# EAGLE design wristband-pcb (EAGLE 9.6.2)
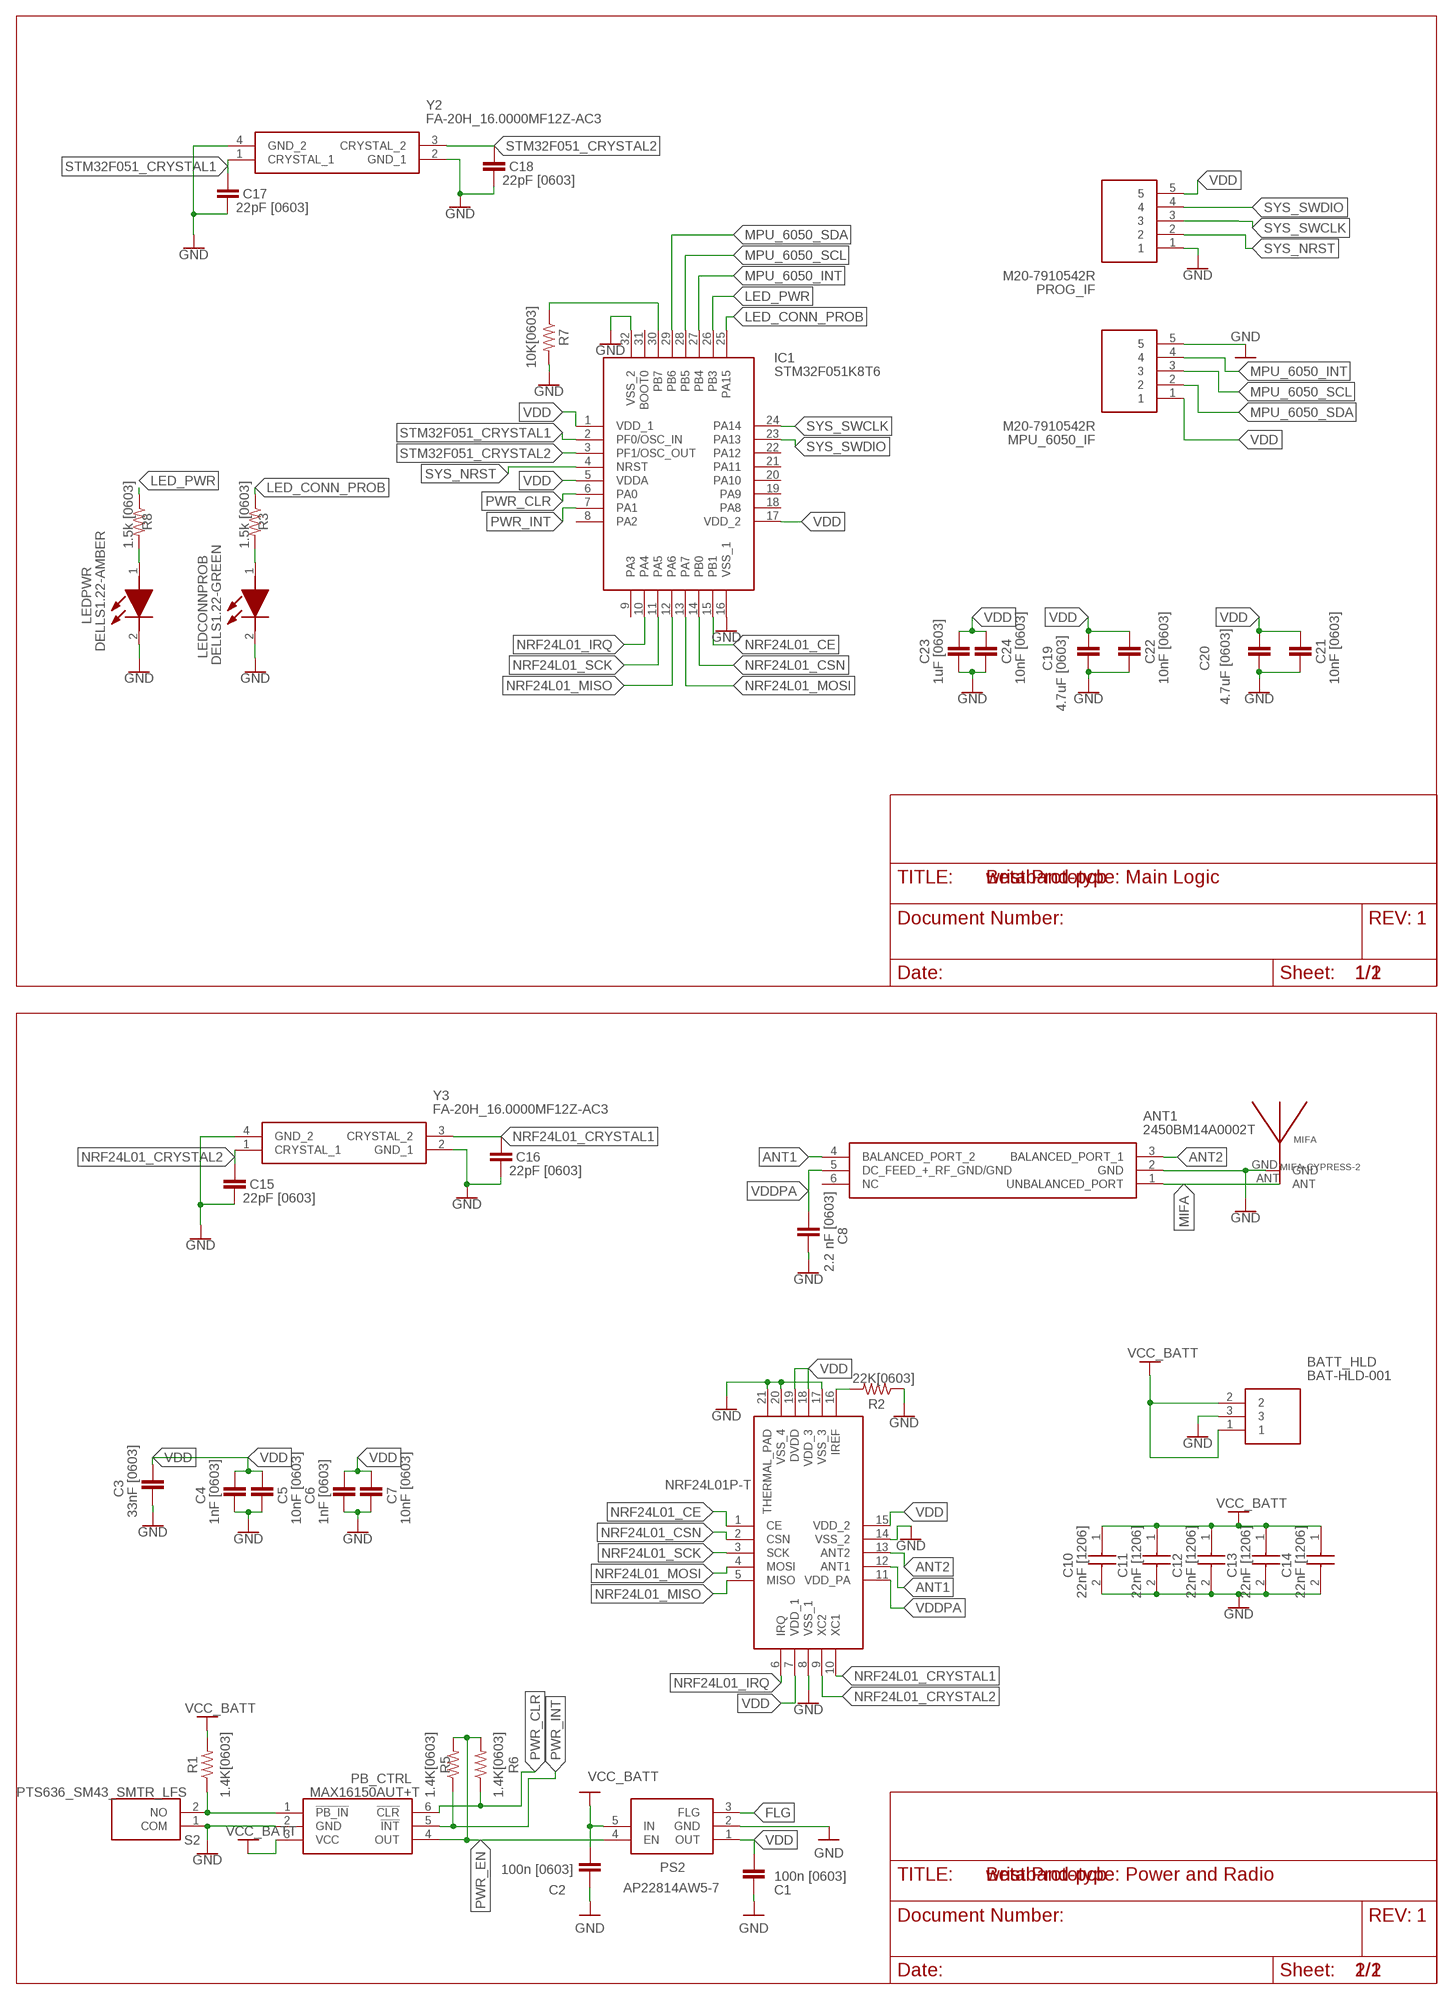
[diagram p0: schematic, sheet 1]

## Parts
ANT1  2450BM14A0002T  [2450BM14A0002T]
BATT_HLD  BAT-HLD-001  [BATHLD001]
C1  100n [0603]  C_CHIP-0603(1608-METRIC)  [CAPC1608X85]
C2  100n [0603]  C_CHIP-0603(1608-METRIC)  [CAPC1608X85]
C3  33nF [0603]  CAPACITOR_0603_L  [RESC0603_L]
C4  1nF [0603]  CAPACITOR_0603_L  [RESC0603_L]
C5  10nF [0603]  CAPACITOR_0603_L  [RESC0603_L]
C6  1nF [0603]  CAPACITOR_0603_L  [RESC0603_L]
C7  10nF [0603]  CAPACITOR_0603_L  [RESC0603_L]
C8  2.2 nF [0603]  CAPACITOR_0603_L  [RESC0603_L]
C10  22nF [1206]  CL31B226KPHNNNE  [CAPC3216X180N]
C11  22nF [1206]  CL31B226KPHNNNE  [CAPC3216X180N]
C12  22nF [1206]  CL31B226KPHNNNE  [CAPC3216X180N]
C13  22nF [1206]  CL31B226KPHNNNE  [CAPC3216X180N]
C14  22nF [1206]  CL31B226KPHNNNE  [CAPC3216X180N]
C15  22pF [0603]  CAPACITOR_0603_L  [RESC0603_L]
C16  22pF [0603]  CAPACITOR_0603_L  [RESC0603_L]
C17  22pF [0603]  CAPACITOR_0603_L  [RESC0603_L]
C18  22pF [0603]  CAPACITOR_0603_L  [RESC0603_L]
C19  4.7uF [0603]  CAPACITOR_0603_L  [RESC0603_L]
C20  4.7uF [0603]  CAPACITOR_0603_L  [RESC0603_L]
C21  10nF [0603]  CAPACITOR_0603_L  [RESC0603_L]
C22  10nF [0603]  CAPACITOR_0603_L  [RESC0603_L]
C23  1uF [0603]  CAPACITOR_0603_L  [RESC0603_L]
C24  10nF [0603]  CAPACITOR_0603_L  [RESC0603_L]
IC1  STM32F051K8T6  [QFP80P900X900X160-32N]
LEDCONNPROB  DELLS1.22-GREEN  KS_DELLS1.22-JHKI-1  [KSDELLS122JHKI1]
LEDPWR  DELLS1.22-AMBER  KS_DELLS1.22-JHKI-1  [KSDELLS122JHKI1]
MIFA  MIFA-CYPRESS-2  [MIFA-CYPRESS-2]
MPU_6050_IF  M20-7910542R  [M207910542R]
NRF24L01+  NRF24L01P-T  [QFN50P400X400X95-21N]
PB_CTRL  MAX16150AUT+T  [SOT95P280X145-6N]
PROG_IF  M20-7910542R  [M207910542R]
PS2  AP22814AW5-7  [SOT95P285X130-5N]
R1  1.4K[0603]  R-US_CHIP-0603(1608-METRIC)  [RESC1608X60]
R2  22K[0603]  R-US_CHIP-0603(1608-METRIC)  [RESC1608X60]
R3  1.5k [0603]  R-US_CHIP-0603(1608-METRIC)  [RESC1608X60]
R5  1.4K[0603]  R-US_CHIP-0603(1608-METRIC)  [RESC1608X60]
R6  1.4K[0603]  R-US_CHIP-0603(1608-METRIC)  [RESC1608X60]
R7  10K[0603]  R-US_CHIP-0603(1608-METRIC)  [RESC1608X60]
R8  1.5k [0603]  R-US_CHIP-0603(1608-METRIC)  [RESC1608X60]
S2  PTS636_SM43_SMTR_LFS  [PTS636SM43SMTRLFS]
Y2  FA-20H_16.0000MF12Z-AC3  [FA20H160000MF12ZAC3]
Y3  FA-20H_16.0000MF12Z-AC3  [FA20H160000MF12ZAC3]

## Nets
ANT1: ANT1.4(BALANCED_PORT_2) NRF24L01+.12(ANT1)
ANT2: ANT1.3(BALANCED_PORT_1) NRF24L01+.13(ANT2)
FLG: PS2.3(FLG)
GND: ANT1.2(GND) BATT_HLD.3 C1.2 C2.2 C3.2 C4.2 C5.2 C6.2 C7.2 C8.2 C10.2 C11.2 C12.2 C13.2 C14.2 C15.2 C16.2 C17.2 C18.2 C19.2 C20.2 C21.2 C22.2 C23.2 C24.2 IC1.16(VSS_1) IC1.32(VSS_2) LEDCONNPROB.2(K) LEDPWR.2(K) MIFA.GND MPU_6050_IF.5 NRF24L01+.8(VSS_1) NRF24L01+.14(VSS_2) NRF24L01+.17(VSS_3) NRF24L01+.20(VSS_4) NRF24L01+.21(THERMAL_PAD) PB_CTRL.2(GND) PROG_IF.1 PS2.2(GND) R2.1 R7.2 S2.1(COM) Y2.2(GND_1) Y2.4(GND_2) Y3.2(GND_1) Y3.4(GND_2)
LED_CONN_PROB: IC1.25(PA15) R3.1
LED_PWR: IC1.26(PB3) R8.1
MIFA: ANT1.1(UNBALANCED_PORT) MIFA.ANT
MPU_6050_INT: IC1.27(PB4) MPU_6050_IF.4
MPU_6050_SCL: IC1.28(PB5) MPU_6050_IF.3
MPU_6050_SDA: IC1.29(PB6) MPU_6050_IF.2
N$2: PB_CTRL.1(!PB_IN) R1.1 S2.2(NO)
N$3: NRF24L01+.16(IREF) R2.2
N$4: IC1.30(PB7) R7.1
N$6: LEDPWR.1(A) R8.2
N$7: LEDCONNPROB.1(A) R3.2
NRF24L01_CE: IC1.15(PB1) NRF24L01+.1(CE)
NRF24L01_CRYSTAL1: C16.1 NRF24L01+.10(XC1) Y3.3(CRYSTAL_2)
NRF24L01_CRYSTAL2: C15.1 NRF24L01+.9(XC2) Y3.1(CRYSTAL_1)
NRF24L01_CSN: IC1.14(PB0) NRF24L01+.2(CSN)
NRF24L01_IRQ: IC1.10(PA4) NRF24L01+.6(IRQ)
NRF24L01_MISO: IC1.12(PA6) NRF24L01+.5(MISO)
NRF24L01_MOSI: IC1.13(PA7) NRF24L01+.4(MOSI)
NRF24L01_SCK: IC1.11(PA5) NRF24L01+.3(SCK)
PWR_CLR: IC1.6(PA0) PB_CTRL.6(!CLR) R6.1
PWR_EN: PB_CTRL.4(OUT) PS2.4(EN) R5.2 R6.2
PWR_INT: IC1.7(PA1) PB_CTRL.5(!INT) R5.1
STM32F051_CRYSTAL1: C17.1 IC1.2(PF0/OSC_IN) Y2.1(CRYSTAL_1)
STM32F051_CRYSTAL2: C18.1 IC1.3(PF1/OSC_OUT) Y2.3(CRYSTAL_2)
SYS_NRST: IC1.4(NRST) PROG_IF.2
SYS_SWCLK: IC1.24(PA14) PROG_IF.3
SYS_SWDIO: IC1.23(PA13) PROG_IF.4
VCC_BATT: BATT_HLD.1 BATT_HLD.2 C2.1 C10.1 C11.1 C12.1 C13.1 C14.1 PB_CTRL.3(VCC) PS2.5(IN) R1.2
VDD: C1.1 C3.1 C4.1 C5.1 C6.1 C7.1 C19.1 C20.1 C21.1 C22.1 C23.1 C24.1 IC1.1(VDD_1) IC1.5(VDDA) IC1.17(VDD_2) MPU_6050_IF.1 NRF24L01+.7(VDD_1) NRF24L01+.15(VDD_2) NRF24L01+.18(VDD_3) NRF24L01+.19(DVDD) PROG_IF.5 PS2.1(OUT)
VDDPA: ANT1.5(DC_FEED_+_RF_GND/GND) C8.1 NRF24L01+.11(VDD_PA)
Unconnected: ANT1.6(NC) IC1.8(PA2) IC1.9(PA3) IC1.18(PA8) IC1.19(PA9) IC1.20(PA10) IC1.21(PA11) IC1.22(PA12) IC1.31(BOOT0)

## Notes on the sheet
- Beta Prototype: Main Logic
- 1
- 1/2
- Beta Prototype: Power and Radio
- 1
- 2/2

## Library data of the parts
ANT1 = 2450BM14A0002T:2450BM14A0002T: JOHANSON TECHNOLOGY - 2450BM14A0002T - BALUN, 2.45GHZ, IMPEDANCE MATCHED Source: Datasheet; DESCRIPTION: JOHANSON TECHNOLOGY - 2450BM14A0002T - BALUN, 2.45GHZ, IMPEDANCE MATCHED; HEIGHT: 0.7mm; MANUFACTURER_NAME: JOHANSON TECHNOLOGY; MANUFACTURER_PART_NUMBER: 2450BM14A0002T; MOUSER_PART_NUMBER: 609-2450BM14A0002T; MOUSER_PRICE-STOCK: https://www.mouser.co.uk/ProductDetail/Johanson-Technology/2450BM14A0002T?qs=yCnrNFeXz%252Bjc2NrpGmrycg%3D%3D
BATT_HLD = BAT-HLD-001:BAT-HLD-001: Coin Cell Battery Holders Linx CR2032 Battery Holder Source: Datasheet; DESCRIPTION: Coin Cell Battery Holders Linx CR2032 Battery Holder; HEIGHT: 4mm; MANUFACTURER_NAME: Linx Technologies; MANUFACTURER_PART_NUMBER: BAT-HLD-001; MOUSER_PART_NUMBER: 712-BAT-HLD-001; MOUSER_PRICE-STOCK: https://www.mouser.co.uk/ProductDetail/Linx-Technologies/BAT-HLD-001?qs=K5ta8V%252BWhta7hbVGfm4dqA%3D%3D
C1 C2 = Capacitor:C: Capacitor - Generic; CATEGORY: Capacitor
C3-C8 C15-C24 = Nordic_nRF:CAPACITOR: Generic chip capacitor
C10-C14 = CL31B226KPHNNNE:CL31B226KPHNNNE: 22F +/-10% 10V Ceramic Capacitor X7R 1206 (3216 Metric) Source: Datasheet <https://media.digikey.com/pdf/Data Sheets/Samsung PDFs/CL_Series_MLCC_ds.pdf>; DESCRIPTION: 22F +/-10% 10V Ceramic Capacitor X7R 1206 (3216 Metric); HEIGHT: 1.8mm; MANUFACTURER_NAME: Samsung Electro-Mechanics; MANUFACTURER_PART_NUMBER: CL31B226KPHNNNE; MOUSER_PART_NUMBER: N/A; MOUSER_PRICE-STOCK: https://www.mouser.co.uk/ProductDetail/Samsung-Electro-Mechanics/CL31B226KPHNNNE?qs=EHbfJsBkB6nWZLDFWYPW4w%3D%3D
IC1 = stm32f051k8t6:STM32F051K8T6: Source: Datasheet <http://www.st.com/web/en/resource/technical/document/datasheet/DM00039193.pdf>; HEIGHT: 1.6mm; MANUFACTURER_NAME: STMicroelectronics; MANUFACTURER_PART_NUMBER: STM32F051K8T6; MOUSER_PART_NUMBER: 511-STM32F051K8T6; MOUSER_PRICE-STOCK: https://www.mouser.co.uk/ProductDetail/STMicroelectronics/STM32F051K8T6?qs=gNDSiZmRJS8MM9puf%252Bb4Hg%3D%3D
LEDCONNPROB LEDPWR = KS_DELLS1.22-JHKI-1:KS_DELLS1.22-JHKI-1: Standard LEDs - SMD Super Red TOPLED E 1608 Source: Datasheet; DESCRIPTION: Standard LEDs - SMD Super Red TOPLED E 1608; HEIGHT: mm; MANUFACTURER_NAME: OSRAM; MANUFACTURER_PART_NUMBER: KS DELLS1.22-JHKI-1; MOUSER_PART_NUMBER: 720-KSDELLS122A4852; MOUSER_PRICE-STOCK: https://www.mouser.co.uk/ProductDetail/OSRAM-Opto-Semiconductors/KS-DELLS122-JHKI-1?qs=XeJtXLiO41SvlpLmj7zjqg%3D%3D
MIFA = MIFA:MIFA-CYPRESS
MPU_6050_IF PROG_IF = M20-7910542R:M20-7910542R: Headers & Wire Housings 5 WAY SIL HORIZ SMT SKT T&R Source: Datasheet <https://cdn.harwin.com/pdfs/M20-791R.pdf>; DESCRIPTION: Headers & Wire Housings 5 WAY SIL HORIZ SMT SKT T&R; HEIGHT: 2.65mm; MANUFACTURER_NAME: Harwin; MANUFACTURER_PART_NUMBER: M20-7910542R; MOUSER_PART_NUMBER: 855-M20-7910542R; MOUSER_PRICE-STOCK: https://www.mouser.co.uk/ProductDetail/Harwin/M20-7910542R?qs=k41KVqW3ymo1Rw%252BkrmwYbQ%3D%3D
NRF24L01+ = nRF24L01P-T:NRF24L01P-T: RF Transceiver IC 2.4GHz ISM Band QFN20 Nordic Semiconductor NRF24L01P-T, RF Transceiver 2400MHz to 2483.5MHz 1.9 3.6 V 20-Pin QFN Source: Datasheet <http://www.nordicsemi.com/eng/content/download/2726/34069/file/nRF24L01P_Product_Specification_1_0.pdf>; DESCRIPTION: RF Transceiver IC 2.4GHz ISM Band QFN20 Nordic Semiconductor NRF24L01P-T, RF Transceiver 2400MHz to 2483.5MHz 1.9 3.6 V 20-Pin QFN; HEIGHT: 0.95mm; MANUFACTURER_NAME: Nordic Semiconductor; MANUFACTURER_PART_NUMBER: nRF24L01P-T; MOUSER_PART_NUMBER: 949-NRF24L01P-T; MOUSER_PRICE-STOCK: https://www.mouser.co.uk/ProductDetail/Nordic-Semiconductor/nRF24L01P-T?qs=yd0qOhnSiDf9ybbDsku6vg%3D%3D
PB_CTRL = MAX16150AUT+T:MAX16150AUT+T: Supervisory Circuits Nano-Power Pushbutton ON/OFF Controller with 15kV ESD Protection and Programmable Timer Source: Datasheet; DESCRIPTION: Supervisory Circuits Nano-Power Pushbutton ON/OFF Controller with 15kV ESD Protection and Programmable Timer; HEIGHT: 1.45mm; MANUFACTURER_NAME: Maxim Integrated; MANUFACTURER_PART_NUMBER: MAX16150AUT+T; MOUSER_PART_NUMBER: 700-MAX16150AUT+T; MOUSER_PRICE-STOCK: https://www.mouser.co.uk/ProductDetail/Maxim-Integrated/MAX16150AUT%2bT?qs=wnTfsH77Xs5xR8unQygqcw%3D%3D
PS2 = AP22814AW5-7:AP22814AW5-7: DiodesZetex AP22814AW5-7, USB Power Switch, High Side, 65m, 1.6 V min. 5-Pin, SOT25 Source: Datasheet <https://componentsearchengine.com/Datasheets/2/AP22814AW5-7.pdf>; DESCRIPTION: DiodesZetex AP22814AW5-7, USB Power Switch, High Side, 65m, 1.6 V min. 5-Pin, SOT25; HEIGHT: 1.3mm; MANUFACTURER_NAME: Diodes Inc.; MANUFACTURER_PART_NUMBER: AP22814AW5-7; MOUSER_PART_NUMBER: 621-AP22814AW5-7; MOUSER_PRICE-STOCK: https://www.mouser.co.uk/ProductDetail/Diodes-Incorporated/AP22814AW5-7?qs=lqAf%2FiVYw9i7Wkgkb62RxQ%3D%3D
R1-R3 R5-R8 = Resistor:R-US: Resistor Fixed - ANSI; CATEGORY: Resistor; SUB-CATEGORY: Fixed
S2 = PTS636_SM43_SMTR_LFS:PTS636_SM43_SMTR_LFS: Tactile Switches Tact 50mA 12VDC, 6.0x3.5, 4.3mm H, 180gf, G leads, No ground pin, Black Actuator Source: Datasheet <https://componentsearchengine.com/Datasheets/1/PTS636 SM43 SMTR LFS.pdf>; DESCRIPTION: Tactile Switches Tact 50mA 12VDC, 6.0x3.5, 4.3mm H, 180gf, G leads, No ground pin, Black Actuator; HEIGHT: 4.5mm; MANUFACTURER_NAME: C & K COMPONENTS; MANUFACTURER_PART_NUMBER: PTS636 SM43 SMTR LFS; MOUSER_PART_NUMBER: 611-PTS636SM43SMTRLF; MOUSER_PRICE-STOCK: https://www.mouser.co.uk/ProductDetail/CK/PTS636-SM43-SMTR-LFS?qs=vLWxofP3U2xu5raMGkTmHg%3D%3D
Y2 Y3 = FA-20H_16.0000MF12Z-AC3:FA-20H_16.0000MF12Z-AC3: Crystals 16MHz 10ppm 9pF -20C +75C Source: Datasheet <https://support.epson.biz/td/api/doc_check.php?dl=brief_FA-20H&lang=en>; DESCRIPTION: Crystals 16MHz 10ppm 9pF -20C +75C; HEIGHT: 0.55mm; MANUFACTURER_NAME: Epson Timing; MANUFACTURER_PART_NUMBER: FA-20H 16.0000MF12Z-AC3; MOUSER_PART_NUMBER: 732-FA20H-16F12Z-AC3; MOUSER_PRICE-STOCK: https://www.mouser.co.uk/ProductDetail/Epson-Timing/FA-20H-160000MF12Z-AC3?qs=CANAagUtPAosthvbGV1%2FdA%3D%3D

## Board
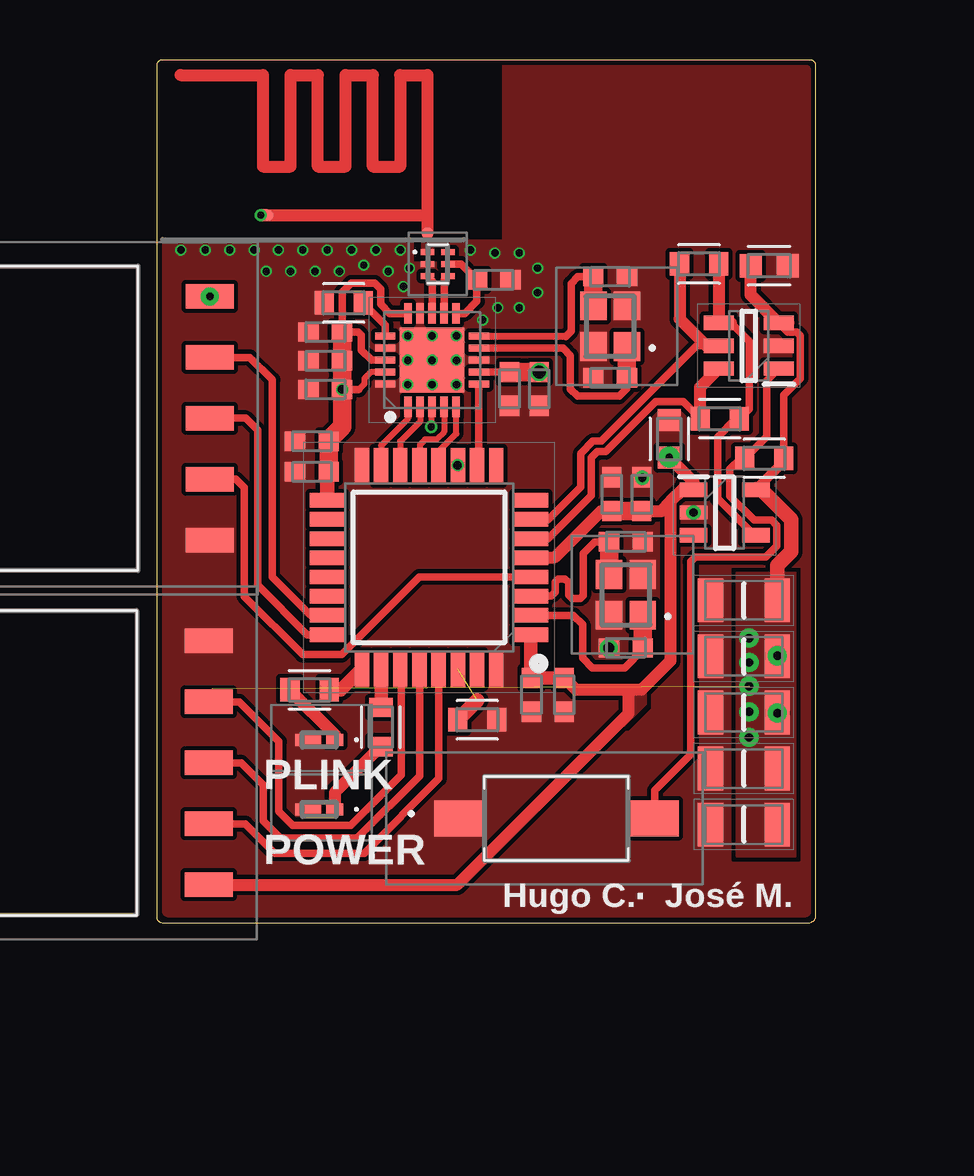
[diagram p1: board, top side]
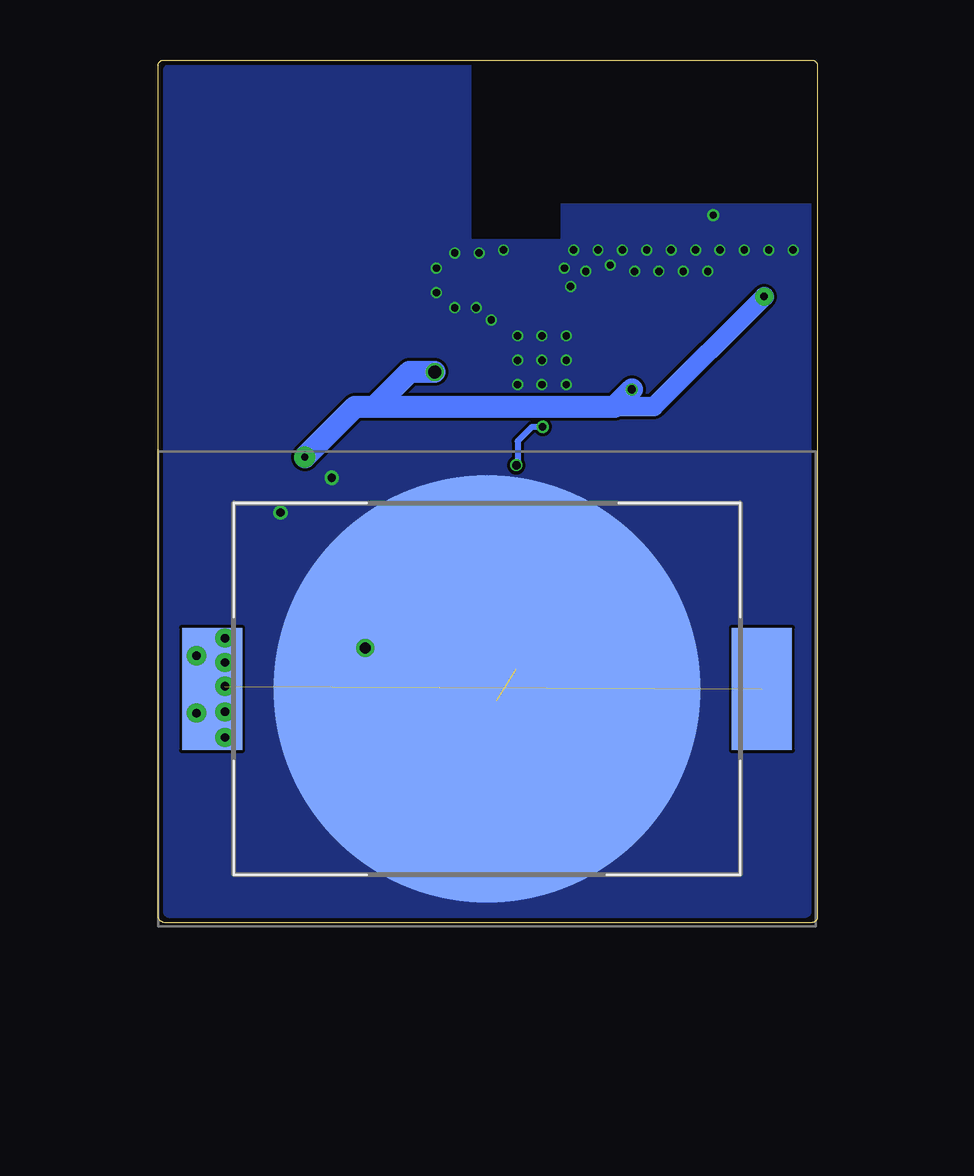
[diagram p2: board, bottom side, seen from below]

Size 27.48 x 35.96 mm. Coordinates in mm from the lower left corner, seen from the top.
Outline: 0,35.71 0,0.25 arc90 0.25,0 27.22,0 arc67 27.48,0.25 27.48,35.71 arc90 27.22,35.96 0.25,35.96 arc90 0,35.71
Copper layers (1*16): Top 0.035mm / dielectric 1.6mm / Bottom 0.035mm
Design rules "jlcpcb-2layer": minimum track width 5mil, minimum drill 0.3mm, track to track 5mil, track to pad 5mil, pad to pad 5mil, via to via 5mil, smd to smd 5mil, copper to edge 0.2mm, drill to drill 6mil, minimum pad ring 10mil, minimum via ring 3mil, stop-mask expansion 4mil, vias tented up to drill 0mil, thermal gap 10mil

### Footprints (pad centres in the part's own frame; a part is rotated, then mirrored left to right if it is on the bottom)
2450BM14A0002T = smd 0.25 x 0.55: 1 0.5,0.425; 2 0,0.425; 3 -0.5,0.425; 4 -0.5,-0.425; 5 0,-0.425; 6 0.5,-0.425
BATHLD001 = smd 2.5 x 5.1: 1 11.45,0; 2 -11.45,0 | smd 17.8 x 17.8: 3 0,0
CAPC1608X85 = smd 0.921 x 0.97: 1 -0.775,0; 2 0.775,0
RESC0603_L = smd 0.85 x 0.8: 1 -0.7,0; 2 0.7,0
CAPC3216X180N = smd 1.05 x 1.82: 1 -1.39,0; 2 1.39,0
QFP80P900X900X160-32N = smd 1.475 x 0.6: 1 -4.238,2.8; 2 -4.238,2; 3 -4.238,1.2; 4 -4.238,0.4; 5 -4.238,-0.4; 6 -4.238,-1.2; 7 -4.238,-2; 8 -4.238,-2.8; 17 4.238,-2.8; 18 4.238,-2; 19 4.238,-1.2; 20 4.238,-0.4; 21 4.238,0.4; 22 4.238,1.2; 23 4.238,2; 24 4.238,2.8 | smd 0.6 x 1.475: 9 -2.8,-4.238; 10 -2,-4.238; 11 -1.2,-4.238; 12 -0.4,-4.238; 13 0.4,-4.238; 14 1.2,-4.238; 15 2,-4.238; 16 2.8,-4.238; 25 2.8,4.238; 26 2,4.238; 27 1.2,4.238; 28 0.4,4.238; 29 -0.4,4.238; 30 -1.2,4.238; 31 -2,4.238; 32 -2.8,4.238
KSDELLS122JHKI1 = smd 0.7 x 0.5: 1 -0.646,0 | smd 1.05 x 0.5: 2 0.47,0
MIFA-CYPRESS-2 = smd 0.508 x 0.508: ANT 0.254,0 | smd 0.508 x 0.762: GND 1.016,6.807
M207910542R = smd 1.02 x 2: 1 -5.08,-5.25; 2 -2.54,-5.25; 3 0,-5.25; 4 2.54,-5.25; 5 5.08,-5.25
QFN50P400X400X95-21N = smd 0.85 x 0.3: 1 -1.95,1; 2 -1.95,0.5; 3 -1.95,0; 4 -1.95,-0.5; 5 -1.95,-1; 11 1.95,-1; 12 1.95,-0.5; 13 1.95,0; 14 1.95,0.5; 15 1.95,1 | smd 0.3 x 0.85: 6 -1,-1.95; 7 -0.5,-1.95; 8 0,-1.95; 9 0.5,-1.95; 10 1,-1.95; 16 1,1.95; 17 0.5,1.95; 18 0,1.95; 19 -0.5,1.95; 20 -1,1.95 | smd 2.7 x 2.7: 21 0,0
SOT95P280X145-6N = smd 1.25 x 0.6: 1 -1.25,0.95; 2 -1.25,0; 3 -1.25,-0.95; 4 1.25,-0.95; 5 1.25,0; 6 1.25,0.95
SOT95P285X130-5N = smd 1.15 x 0.6: 1 -1.3,0.95; 2 -1.3,0; 3 -1.3,-0.95; 4 1.3,-0.95; 5 1.3,0.95
RESC1608X60 = smd 0.799 x 0.974: 1 -0.815,0; 2 0.815,0
PTS636SM43SMTRLFS = smd 2 x 1.5: 1 -4.1,0; 2 4.1,0
FA20H160000MF12ZAC3 = smd 1.2 x 1.1: 1 -0.85,-0.7; 2 0.85,-0.7; 3 0.85,0.7; 4 -0.85,0.7

### Placement (x,y rotation side)
ANT1  11.72,27.45 90 top
BATT_HLD  13.77,9.74 180 bottom
C1  21.36,20.17 90 top
C2  25.53,27.38 0 top
C3  7.04,22.22 180 top
C4  7.04,24.61 180 top
C5  7.04,23.42 180 top
C6  15.95,22.25 270 top
C7  14.71,22.25 270 top
C8  14.05,26.8 0 top
C10  24.47,8.76 180 top
C11  24.47,13.44 180 top
C12  24.47,11.1 180 top
C13  24.47,4.09 180 top
C14  24.47,6.43 180 top
C15  18.9,22.71 180 top
C16  18.9,26.92 0 top
C17  19.56,11.46 180 top
C18  19.56,15.87 0 top
C19  6.48,18.8 180 top
C20  16.99,9.5 270 top
C21  15.62,9.5 270 top
C22  6.48,20.07 180 top
C23  18.97,17.86 90 top
C24  20.22,17.86 90 top
IC1  11.35,14.81 180 top
LEDCONNPROB  6.78,7.62 180 top
LEDPWR  6.78,4.72 180 top
MIFA  11.3,28.47 90 top
MPU_6050_IF  -3.08,6.66 90 top
NRF24L01+  11.48,23.44 90 top
PB_CTRL  24.68,24.04 180 top
PROG_IF  -3.02,21.02 90 top
PS2  23.67,17.09 0 top
R1  25.32,19.35 0 top
R2  7.8,25.83 0 top
R3  6.38,9.7 180 top
R5  22.61,27.46 0 top
R6  23.47,21.01 0 top
R7  13.36,8.46 0 top
R8  9.35,8.15 270 top
S2  16.66,4.34 0 top
Y2  19.56,13.67 90 top
Y3  18.9,24.86 90 top

### Tracks (layer width: path | path; a pad name or v marks a point on that pad's centre or on a via)
ANT1
  Top 0.305: NRF24L01+.12 12,26.81 ANT1.4
ANT2
  Top 0.305: NRF24L01+.13 11.5,26.75 ANT1.3
GND  (via drill 0.3 pad 0.38, 0.3 pad 0.51, 0.35 pad 0.6, 0.45 pad 0.75)
  Top 0.127: MIFA.GND v4.34,29.49
  other vias: 22.37,17.09 18.85,11.46 1.02,28.04 2.03,28.04 3.05,28.04 4.06,28.04 4.57,27.15 5.59,27.15 5.08,28.04 6.1,28.04 7.11,28.04 6.6,27.15 15.11,27.91 7.62,27.15 8.64,27.41 8.13,28.04 9.14,28.04 10.16,28.04 9.65,27.15 10.54,27.28 13.08,28.04 14.1,27.91 15.88,27.28 10.29,26.52 15.88,26.26 15.11,25.63 14.22,25.63 10.46,24.46 10.46,23.44 10.46,22.43 11.48,23.44 11.48,24.46 11.48,22.43 12.5,24.46 12.5,23.44 12.5,22.43 13.59,25.12 20.24,18.54
  pour Bottom (no thermals): 10.69,29.95 10.69,28.47 14.43,28.47 14.43,35.76 27,35.76 arc-90 27.25,35.51 27.25,0.48 arc-90 27,0.23 0.51,0.23 arc-90 0.25,0.48 0.25,29.95
  pour Top (isolate 0.178, rank 3, no thermals): 27,0.23 0.51,0.23 arc-90 0.25,0.48 0.25,28.47 10.69,28.47 10.69,27.56 11.89,27.56 11.89,28.47 14.43,28.47 14.43,35.76 27,35.76 arc-90 27.25,35.51 27.25,0.48 arc-90
LED_CONN_PROB
  Top 0.559: IC1.25 7.69,9.7 R3.1
LED_PWR
  Top 0.559: IC1.26 R8.1
MIFA
  pour Top (no thermals): 11.07,28.68 11.51,28.68 11.51,27.84 11.07,27.84
MPU_6050_INT
  Top 0.305: IC1.27 10.21,10.52 10.21,6.17 8.1,4.06 5.67,4.06 5.1,4.64 5.1,7.55 3.44,9.2 MPU_6050_IF.4
MPU_6050_SCL
  Top 0.305: IC1.28 10.96,10.56 10.96,6.12 8.37,3.53 5.16,3.53 4.45,4.24 4.45,5.74 3.52,6.66 MPU_6050_IF.3
MPU_6050_SDA
  Top 0.305: IC1.29 11.76,10.56 11.76,6 8.65,2.9 4.93,2.9 3.7,4.12 MPU_6050_IF.2
N$2
  Top 0.305: PB_CTRL.1 25.42,22.59 25.42,20.27 R1.1 24.35,19.35 23.89,18.9 23.89,17.78 24.9,16.77 25.64,16.77 25.85,16.56 25.85,15.7 25.38,15.23 22.44,15.23 22.26,15.05 22.26,7 20.76,5.51 S2.2
N$3
  Top 0.305: R2.2 9.53,24.91 NRF24L01+.16
N$4  (1 unrouted)
  Top 0.61: 13.35,9.27 R7.1
N$6
  Top 0.508: R8.2 7.43,5.42 LEDPWR.1
N$7
  Top 0.508: R3.2 7.43,7.83 LEDCONNPROB.1
NRF24L01_CE
  Top 0.254: NRF24L01+.1 10.48,21.02 9.35,19.89 IC1.15
NRF24L01_CRYSTAL1
  Top 0.305: NRF24L01+.10 17.04,24.43 17.27,24.66 17.27,26.64 17.55,26.92 C16.1
  Top 0.762: C16.1 Y3.3
NRF24L01_CRYSTAL2
  Top 0.305: NRF24L01+.9 16.95,23.94 17.25,23.65 17.25,22.25 17.55,21.95 19.28,21.95 19.6,22.26 C15.1
  Top 0.762: Y3.1 C15.1
NRF24L01_CSN
  Top 0.254: NRF24L01+.2 10.98,20.89 10.15,20.06 IC1.14
NRF24L01_IRQ
  Top 0.305: NRF24L01+.6 13.43,19.12 IC1.10
NRF24L01_MISO
  Top 0.254: NRF24L01+.5 12.5,21.48 12.5,20.39 11.82,19.71 11.82,19.12
  Top 0.305: IC1.12 11.82,19.12
NRF24L01_MOSI
  Top 0.254: NRF24L01+.4 11.98,20.45 11.66,20.14 11.2,20.14 10.97,19.92 10.97,19.06
  Top 0.305: 10.97,19.06 IC1.13
NRF24L01_SCK  (via drill 0.3 pad 0.51, 0.35)
  Top 0.254: NRF24L01+.3 11.46,21.47 v11.46,20.67 v11.45,20.67
  Top 0.305: IC1.11 v12.55,19.06
  Bottom 0.254: v11.45,20.67 11.9,20.67 12.5,20.07 12.5,19.12 v12.55,19.06
PWR_CLR
  Top 0.305: IC1.6 16.31,16.01 18.11,17.8 18.11,19.38 18.36,19.63 18.71,19.63 20.8,21.72 21.94,21.72 R6.1
  Top 0.508: R6.1 22.65,22.32 PB_CTRL.6
PWR_EN
  Top 0.305: 23.94,24.99 24.69,24.25 24.69,21.42 R6.2 | PS2.4 24.92,16.14 23.38,17.68 23.38,20.24 24.14,21.01 R6.2
  Top 0.508: R5.2 PB_CTRL.4 23.94,24.99 | R6.2
PWR_INT
  Top 0.305: IC1.7 16.33,16.81 17.68,18.16 17.68,19.56 18.18,20.07 18.53,20.07 22.51,24.04 PB_CTRL.5
  Top 0.508: R5.1 21.79,25.17 22.91,24.04 PB_CTRL.5
S$2  (via drill 0.35 pad 0.8)
  other vias: 25.87,8.74
STM32F051_CRYSTAL1
  Top 0.305: C17.1 20.26,11.38 19.5,10.62 18.16,10.62 17.75,11.04 17.75,12.43 17.37,12.81 IC1.2
  Top 0.762: C17.1 Y2.1
STM32F051_CRYSTAL2
  Top 0.305: C18.1 18.26,15.87 17.78,15.39 17.78,13.64 17.65,13.51 17.32,13.51 17.17,13.66 17.17,14.17 17.02,14.33 16.74,14.33 16.61,14.2 16.61,13.79 16.45,13.63 15.61,13.63 IC1.3
  Top 0.762: C18.1 Y2.3
SYS_NRST
  Top 0.305: IC1.4 10.95,14.41 7.71,11.17 6.08,11.17 3.66,13.6 3.66,18.14 3.31,18.48 PROG_IF.2
SYS_SWCLK
  Top 0.305: IC1.24 7.11,12 6.29,12 4.22,14.07 4.22,20.52 3.72,21.02 PROG_IF.3
SYS_SWDIO
  Top 0.305: IC1.23 7.1,12.83 6.42,12.83 4.83,14.41 4.83,22.63 3.89,23.56 PROG_IF.4
VCC_BATT  (via drill 0.35 pad 0.8)  (1 unrouted)
  Top 0.305: PB_CTRL.3 26.3,24.62 26.67,24.62 26.83,24.46 26.83,22.68 26.14,21.99 R1.2
  Top 0.406: PB_CTRL.3 26.37,24.99 | R1.2 26.14,19.21 PS2.5
  Top 0.508: PB_CTRL.3 24.75,26.17 C2.1
  Top 0.61: C11.1 25.86,14.89 26.44,15.46 26.44,16.8 25.17,18.07 25,18.07 PS2.5
  Bottom 0.15: BATT_HLD.1 24.8,9.74 arc-90 v24.69,9.85
  other vias: 24.69,8.79 24.69,7.72 24.69,10.85 24.69,11.86 25.87,11.13
  pour Top (no thermals): 24.16,14.58 24.16,2.77 26.64,2.77 26.64,14.58
VDD  (via drill 0.3 pad 0.75, 0.3 pad 0.86, 0.35, 0.55 pad 0.75)
  Top 0.254: NRF24L01+.19 8.92,22.94 8.66,22.68 8.66,22.45 8.43,22.22
  Top 0.305: 8.43,22.22 C3.1 | NRF24L01+.18 8.97,23.44 8.53,23.88 8.53,24.49 8.41,24.61 C4.1 7.74,26.28 8.12,26.66 9.08,26.66 9.34,26.41 9.34,25.77 9.72,25.39 NRF24L01+.15 | NRF24L01+.7 C7.1
  Top 0.508: 15.61,15.23 16.59,15.23 18.52,17.16 C23.1 | C24.1 20.23,17.14 21.01,17.14 21.41,17.55 | 19.67,9.71 20.21,9.71 21.41,10.92 21.41,17.55 | 19.67,9.71 17.48,9.71 C20.1 | MPU_6050_IF.1 12.53,1.58 19.67,8.72 19.67,9.71 | 21.41,17.55 21.95,18.08 22.34,18.08 PS2.1 22.37,18.38 C1.1 v21.36,19.41
  Top 0.559: IC1.1 15.59,10.17 C20.1 C21.1 | IC1.5 15.61,15.23
  Top 0.61: IC1.17 7.12,18.5 C19.1
  Top 0.762: C6.1 C7.1 | C19.1 C22.1 7.18,20.12 7.74,20.68 C3.1 C5.1 C4.1 | C23.1 C24.1
  Bottom 0.813: 8.46,21.5 6.82,21.5 PROG_IF.5
  Bottom 0.914: v21.36,19.41 19.26,21.5 18.45,21.5 | 18.45,21.5 17,22.95 C6.1 | 18.45,21.5 8.46,21.5 C3.1
  other vias: 15.95,22.95 7.74,22.22 2.23,26.1
  pour Top: 20.4,9.7 20.4,9.09 19.48,8.18 19.48,9.65 19.53,9.7
VDDPA
  Top 0.305: NRF24L01+.11 12.84,25.39 13.35,25.9 C8.1 12.69,27.45 ANT1.5

### Text on the board
tPlace: PLINK | POWER | Hugo C. José M. | .
tStop: Zephyrus V1